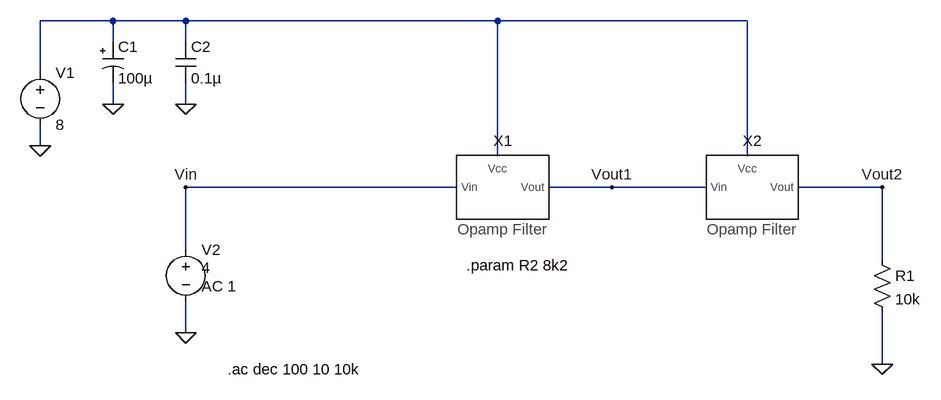
[diagram p0: schematic Exp1.B.3.asc]
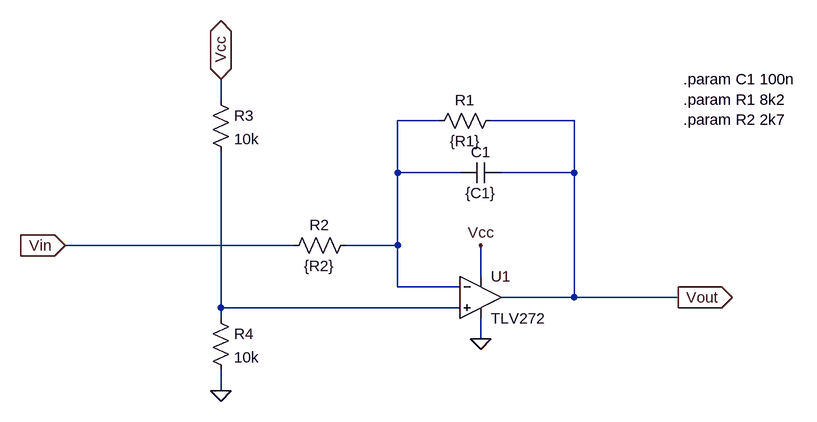
[diagram p1: sub-circuit opamp_filter1.asc]
Exp1.B.3.asc, the LTspice schematic file:
Version 4
SHEET 1 1108 680
WIRE -160 -96 -272 -96
WIRE -48 -96 -160 -96
WIRE 432 -96 -48 -96
WIRE 816 -96 432 -96
WIRE -160 -64 -160 -96
WIRE -48 -64 -48 -96
WIRE -272 -16 -272 -96
WIRE -160 32 -160 0
WIRE -48 32 -48 0
WIRE -272 96 -272 64
WIRE 432 112 432 -96
WIRE 816 112 816 -96
WIRE 368 160 -48 160
WIRE 608 160 512 160
WIRE 752 160 608 160
WIRE 1024 160 896 160
WIRE -48 256 -48 160
WIRE 1024 272 1024 160
WIRE -48 384 -48 336
WIRE 1024 432 1024 352
FLAG -48 384 0
FLAG -272 96 0
FLAG -160 32 0
FLAG -48 32 0
FLAG -48 160 Vin
FLAG 1024 432 0
FLAG 608 160 Vout1
FLAG 1024 160 Vout2
SYMBOL voltage -48 240 R0
WINDOW 3 24 44 Left 2
WINDOW 123 24 72 Left 2
WINDOW 39 0 0 Left 0
SYMATTR Value 4
SYMATTR Value2 AC 1
SYMATTR InstName V2
SYMBOL voltage -272 -32 R0
WINDOW 123 0 0 Left 0
WINDOW 39 0 0 Left 0
SYMATTR InstName V1
SYMATTR Value 8
SYMBOL cap -64 -64 R0
SYMATTR InstName C2
SYMATTR Value 0.1µ
SYMBOL polcap -176 -64 R0
SYMATTR InstName C1
SYMATTR Value 100µ
SYMBOL res 1008 256 R0
SYMATTR InstName R1
SYMATTR Value 10k
SYMBOL opamp_filter1 432 144 R0
WINDOW 0 8 -40 Bottom 2
SYMATTR InstName X1
SYMBOL opamp_filter1 816 144 R0
WINDOW 0 8 -40 Bottom 2
SYMATTR InstName X2
TEXT 16 440 Left 2 !.ac dec 100 10 10k
TEXT 384 280 Left 2 !.param R2 8k2

opamp_filter1.asc, the sub-circuit schematic file:
Version 4
SHEET 1 1140 680
WIRE 240 -80 240 -112
WIRE 576 -48 512 -48
WIRE 784 -48 656 -48
WIRE 512 32 512 -48
WIRE 608 32 512 32
WIRE 784 32 784 -48
WIRE 784 32 672 32
WIRE 352 144 0 144
WIRE 512 144 512 32
WIRE 512 144 432 144
WIRE 640 192 640 144
WIRE 512 208 512 144
WIRE 608 208 512 208
WIRE 784 224 784 32
WIRE 784 224 672 224
WIRE 944 224 784 224
WIRE 240 240 240 0
WIRE 608 240 240 240
WIRE 240 256 240 240
WIRE 640 288 640 256
WIRE 240 368 240 336
FLAG 240 368 0
FLAG 240 -112 Vcc
IOPIN 240 -112 BiDir
FLAG 640 288 0
FLAG 944 224 Vout
IOPIN 944 224 Out
FLAG 0 144 Vin
IOPIN 0 144 In
FLAG 640 144 Vcc
SYMBOL res 224 240 R0
SYMATTR InstName R4
SYMATTR Value 10k
SYMBOL res 224 -96 R0
SYMATTR InstName R3
SYMATTR Value 10k
SYMBOL res 336 160 R270
WINDOW 0 32 56 VTop 2
WINDOW 3 0 56 VBottom 2
SYMATTR InstName R2
SYMATTR Value {R2}
SYMBOL res 560 -32 R270
WINDOW 0 32 56 VTop 2
WINDOW 3 0 56 VBottom 2
SYMATTR InstName R1
SYMATTR Value {R1}
SYMBOL OpAmps\\TLV272 640 224 R0
SYMATTR InstName U1
SYMBOL cap 672 16 R90
WINDOW 0 0 32 VBottom 2
WINDOW 3 32 32 VTop 2
SYMATTR InstName C1
SYMATTR Value {C1}
TEXT 952 -112 Left 2 !.param C1 100n\n.param R1 8k2\n.param R2 2k7

The netlist it stands for:
* Exp1.B.3.asc
V2 Vin 0 4 AC 1
V1 N001 0 8
C2 N001 0 0.1µ
C1 N001 0 100µ
R1 Vout2 0 10k
XX1 Vin N001 Vout1 opamp_filter1
XX2 Vout1 N001 Vout2 opamp_filter1

* block symbol definitions
.subckt opamp_filter1 Vin Vcc Vout
R4 N002 0 10k
R3 Vcc N002 10k
R2 Vin N001 {R2}
R1 N001 Vout {R1}
* U1: TLV272 (symbol OpAmps\TLV272 not available, pins judged from their places): In+=N002 In-=N001 V+=Vcc V-=0 OUT=Vout
C1 Vout N001 {C1}
.param C1 100n
.param R1 8k2
.param R2 2k7
.ends opamp_filter1

.ac dec 100 10 10k
.param R2 8k2
.backanno
.end